# EAGLE schematic Comparator Board New (EAGLE 6.3)
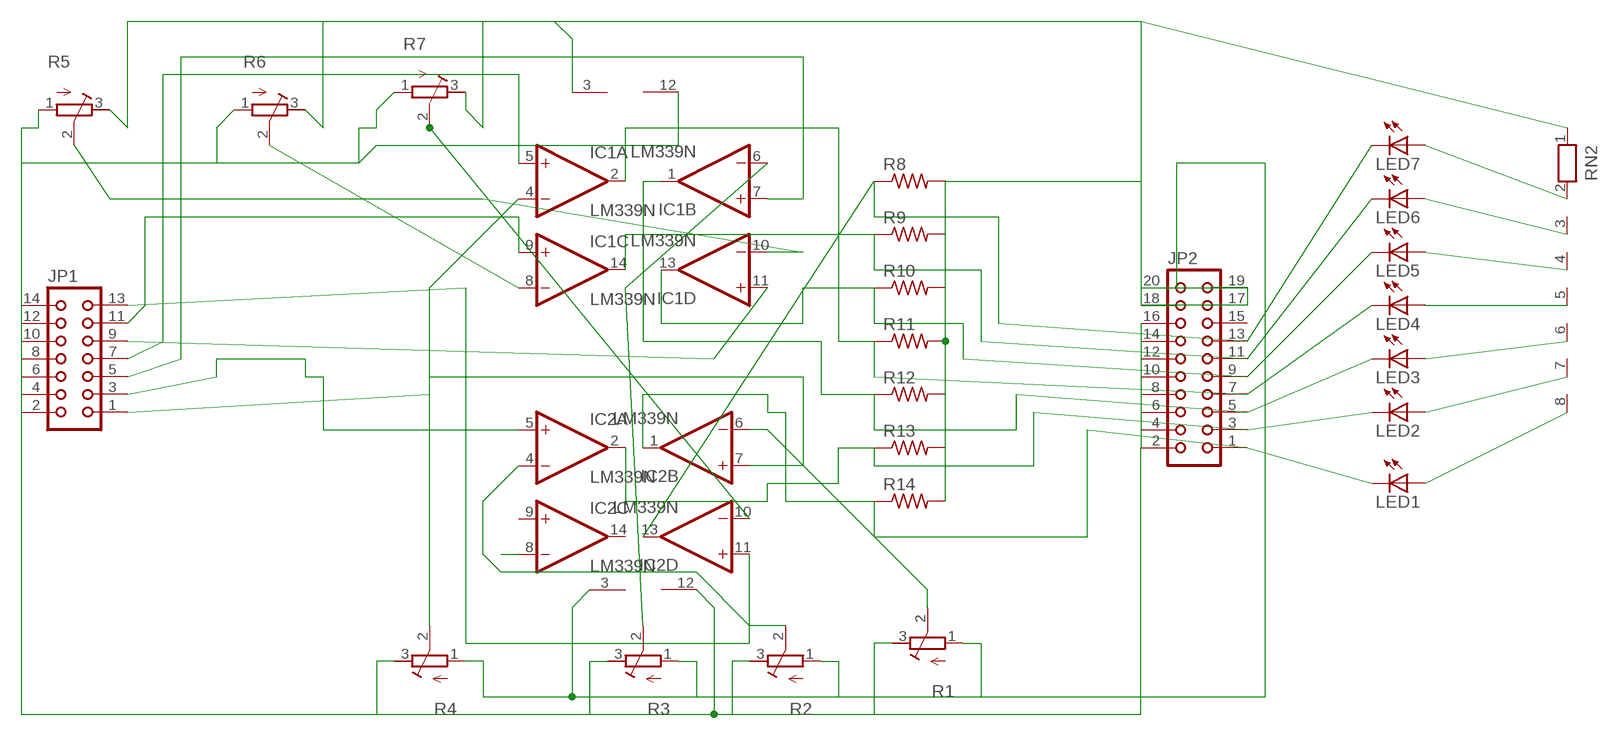
[diagram p0: schematic, sheet 1]

## Parts
IC1  LM339N  [DIL14]
IC2  LM339N  [DIL14]
JP1  CON14  [CON14]
JP2  CON20  [CON20]
LED1  LED3MM  [LED3MM]
LED2  LED3MM  [LED3MM]
LED3  LED3MM  [LED3MM]
LED4  LED3MM  [LED3MM]
LED5  LED3MM  [LED3MM]
LED6  LED3MM  [LED3MM]
LED7  LED3MM  [LED3MM]
R1  R-TRIMM3296W  [RTRIM3296W]
R2  R-TRIMM3296W  [RTRIM3296W]
R3  R-TRIMM3296W  [RTRIM3296W]
R4  R-TRIMM3296W  [RTRIM3296W]
R5  R-TRIMM3296W  [RTRIM3296W]
R6  R-TRIMM3296W  [RTRIM3296W]
R7  R-TRIMM3296W  [RTRIM3296W]
R8  R-US_0207/15  [0207/15]
R9  R-US_0207/15  [0207/15]
R10  R-US_0207/15  [0207/15]
R11  R-US_0207/15  [0207/15]
R12  R-US_0207/15  [0207/15]
R13  R-US_0207/15  [0207/15]
R14  R-US_0207/15  [0207/15]
RN2  RN07  [RN-8]

## Nets
N$1: IC2.7(B:+IN) JP1.1
N$2: IC1.7(B:+IN) JP1.5
N$3: IC1.5(A:+IN) JP1.7
N$4: IC1.11(D:+IN) JP1.9
N$5: IC1.9(C:+IN) JP1.11
N$6: IC2.13(D:OUT) JP2.13 LED7.K(C) R8.1
N$7: IC2.11(D:+IN) JP1.13
N$8: IC2.5(A:+IN) JP1.3
N$9: IC1.14(C:OUT) JP2.11 LED6.K(C) R9.1
N$11: IC2.1(B:OUT) JP2.1 LED1.K(C) R14.1
N$12: IC2.2(A:OUT) JP2.3 LED2.K(C) R13.1
N$13: LED7.A RN2.2
N$14: IC1.12(P:GND) IC2.12(P:GND) JP1.2 JP1.4 JP1.6 JP1.8 JP1.10 JP1.12 JP1.14 JP2.2 JP2.4 JP2.6 JP2.8 JP2.10 JP2.12 JP2.14 JP2.16 R1.3(A) R2.3(A) R3.3(A) R4.3(A) R5.1(E) R6.1(E) R7.1(E)
N$16: IC2.8(C:-IN)
N$17: LED6.A RN2.3
N$18: LED5.A RN2.4
N$19: IC1.1(B:OUT) JP2.5 LED3.K(C) R12.1
N$20: IC1.2(A:OUT) JP2.7 LED4.K(C) R11.1
N$21: IC1.13(D:OUT) JP2.9 LED5.K(C) R10.1
N$22: LED4.A RN2.5
N$23: LED3.A RN2.6
N$24: LED2.A RN2.7
N$25: LED1.A RN2.8
N$26: IC2.6(B:-IN) R1.2(S)
N$27: IC2.4(A:-IN) R2.2(S)
N$28: IC1.6(B:-IN) R3.2(S)
N$29: IC1.4(A:-IN) R4.2(S)
N$30: IC1.10(D:-IN) R5.2(S)
N$31: IC1.8(C:-IN) R6.2(S)
N$32: IC2.10(D:-IN) R7.2(S)
N$33: IC1.3(P:V+) IC2.3(P:V+) JP2.17 JP2.18 JP2.19 JP2.20 R1.1(E) R2.1(E) R3.1(E) R4.1(E) R5.3(A) R6.3(A) R7.3(A) R8.2 R9.2 R10.2 R11.2 R12.2 R13.2 R14.2 RN2.1
Unconnected: IC2.9(C:+IN) IC2.14(C:OUT) JP2.15

## Library data of the parts
IC1 IC2 = linear:LM339: Low Power Low Offset Voltage Quad Comparators with open collector; LM139/LM239/LM339/LM2901/LM3302
JP1 = con-harting:CON14: CONNECTOR
JP2 = con-harting:CON20: CONNECTOR
LED1-LED7 = led:LED: LED OSRAM: - CHIPLED LG R971, LG N971, LY N971, LG Q971, LY Q971, LO R971, LY R971 LH N974, LH R974 LS Q976, LO Q976, LY Q976 LO Q996 - Hyper CHIPLED LW Q18S LB Q993, LB Q99A, LB R99A - SideLED LS A670, LO A670, LY A670, LG A670, LP A670 LB A673, LV A673, LT A673, LW A673 LH A674 LY A675 LS A676, LA A676, LO A676, LY A676, LW A676 LS A679, LY A679, LG A679 - Hyper Micro SIDELED® LS Y876, LA Y876, LO Y876, LY Y876 LT Y87S - SmartLED LW L88C, LW L88S LB L89C, LB L89S, LG L890 LS L89K, LO L89K, LY L89K LS L896, LA L896, LO L896, LY L896 - TOPLED LS T670, LO T670, LY T670, LG T670, LP T670 LSG T670, LSP T670, LSY T670, LOP T670, LYG T670 LG T671, LOG T671, LSG T671 LB T673, LV T673, LT T673, LW T673 LH T674 LS T676, LA T676, LO T676, LY T676, LB T676, LH T676, LSB T676, LW T676 LB T67C, LV T67C, LT T67C, LS T67K, LO T67K, LY T67K, LW E67C LS E67B, LA E67B, LO E67B, LY E67B, LB E67C, LV E67C, LT E67C LW T67C LS T679, LY T679, LG T679 LS T770, LO T770, LY T770, LG T770, LP T770 LB T773, LV T773, LT T773, LW T773 LH T774 LS E675, LA E675, LY E675, LS T675 LS T776, LA T776, LO T776, LY T776, LB T776 LHGB T686 LT T68C, LB T68C - Hyper Mini TOPLED® LB M676 - Mini TOPLED Santana® LG M470 LS M47K, LO M47K, LY M47K Source: http://www.osram.convergy.de LUXEON: - LUMILED® LXK2-PW12-R00, LXK2-PW12-S00, LXK2-PW14-U00, LXK2-PW14-V00 LXK2-PM12-R00, LXK2-PM12-S00, LXK2-PM14-U00 LXK2-PE12-Q00, LXK2-PE12-R00, LXK2-PE12-S00, LXK2-PE14-T00, LXK2-PE14-U00 LXK2-PB12-K00, LXK2-PB12-L00, LXK2-PB12-M00, LXK2-PB14-N00, LXK2-PB14-P00, LXK2-PB14-Q00 LXK2-PR12-L00, LXK2-PR12-M00, LXK2-PR14-Q00, LXK2-PR14-R00 LXK2-PD12-Q00, LXK2-PD12-R00, LXK2-PD12-S00 LXK2-PH12-R00, LXK2-PH12-S00 LXK2-PL12-P00, LXK2-PL12-Q00, LXK2-PL12-R00 Source: www.luxeon.com KINGBRIGHT: KA-3528ASYC Source: www.kingbright.com
R1-R7 = rcl:R-TRIMM: Trimm resistor
R8-R14 = rcl:R-US_: RESISTOR, American symbol
RN2 = resistor-net:RN07: RESISTOR NETWORK